# EAGLE design wavelet7 (EAGLE 9.2.1)
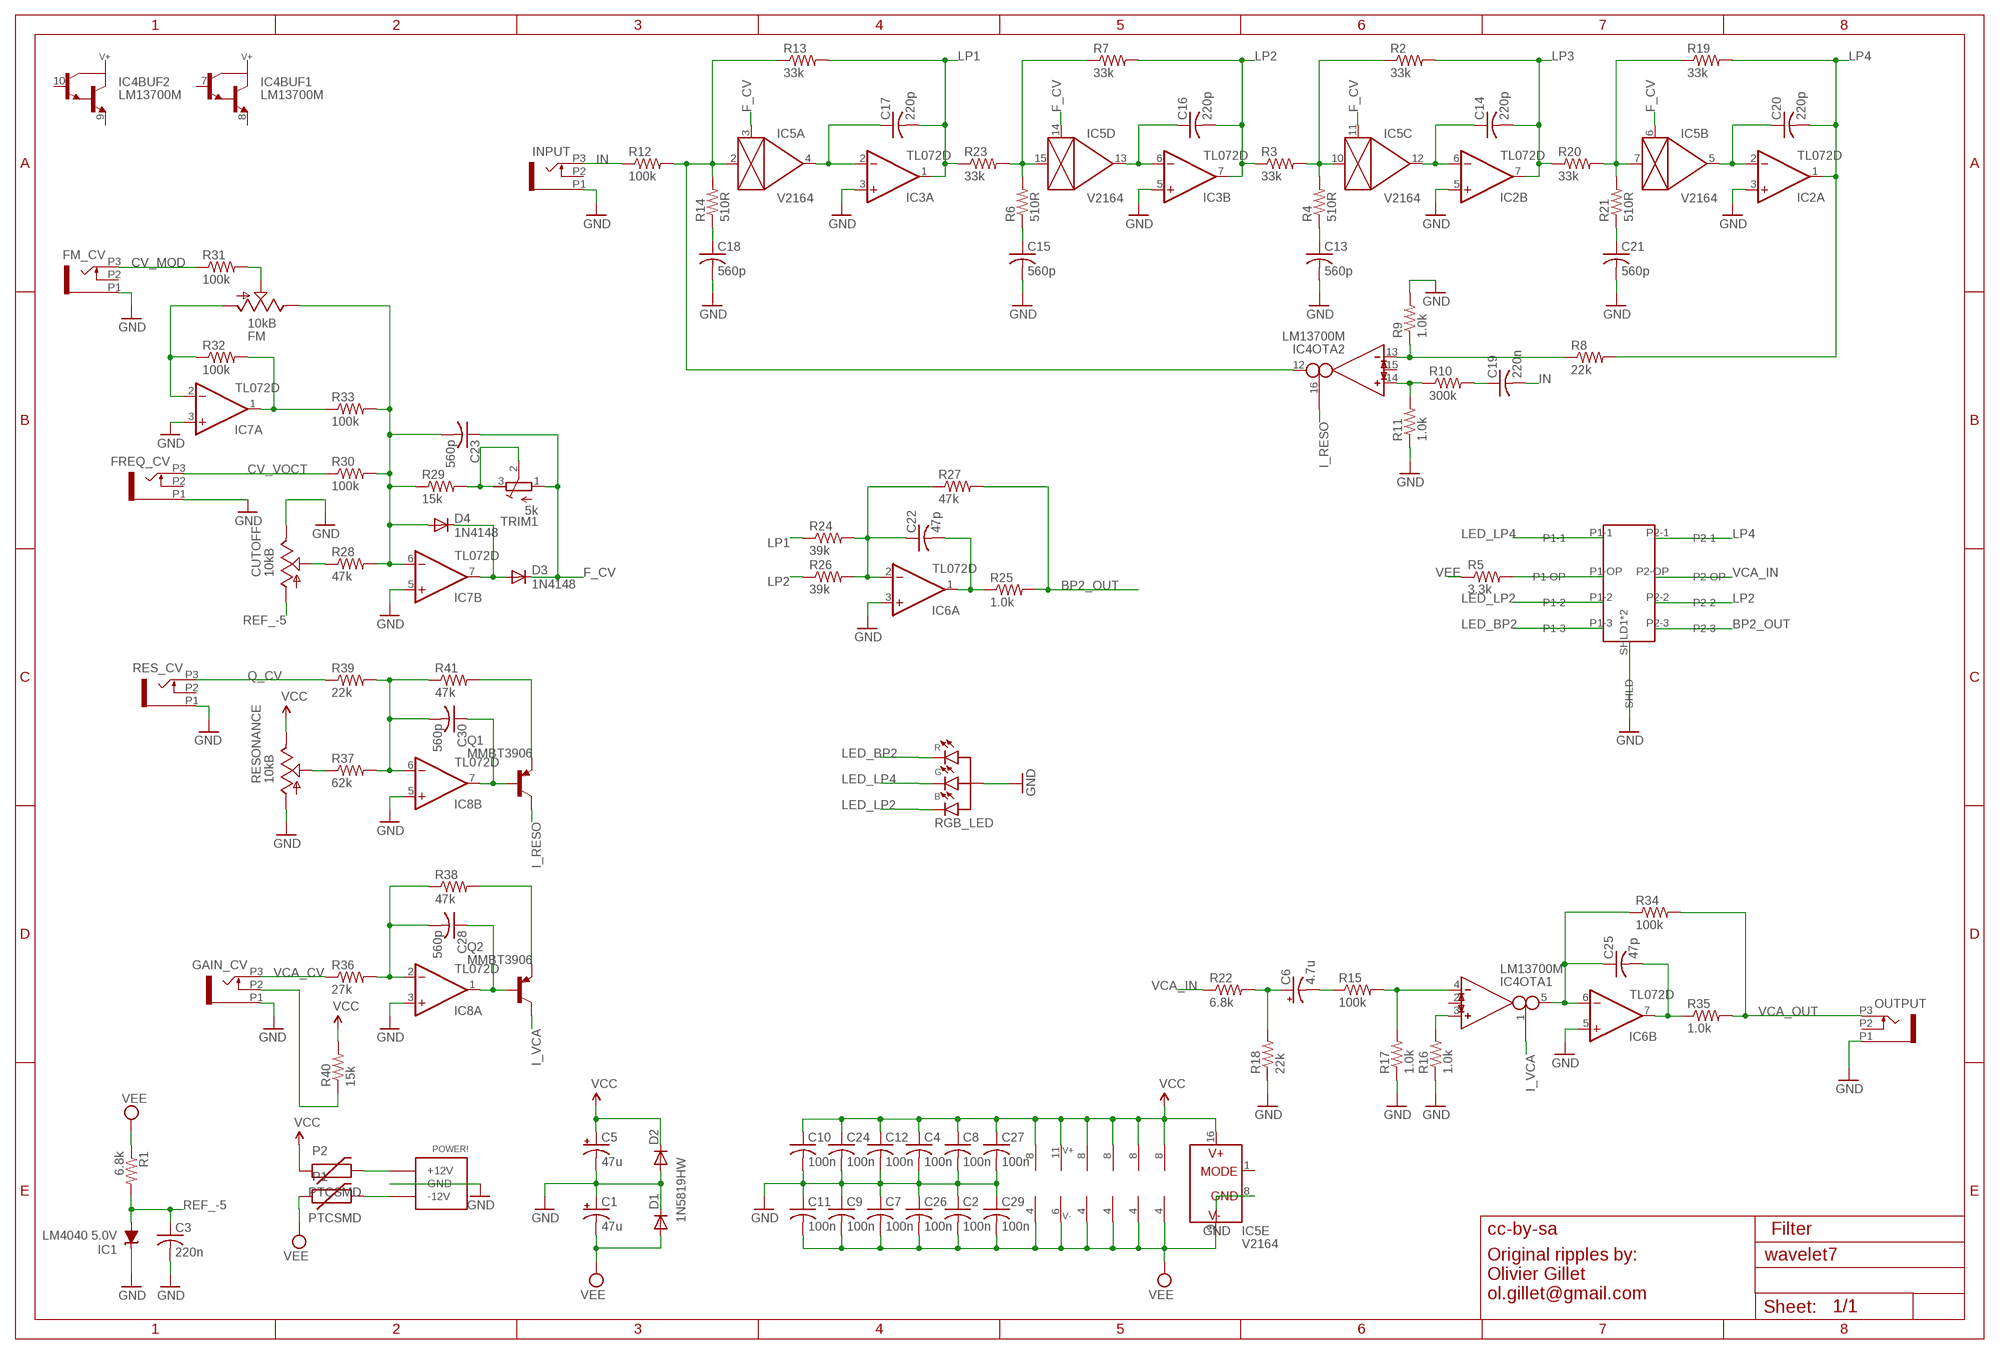
[diagram p0: schematic, sheet 1]

## Parts
C1  47u  CPOL-USD  [PANASONIC_D]
C2  100n  C-USC0603  [C0603]
C3  220n  C-USC0603  [C0603]
C4  100n  C-USC0603  [C0603]
C5  47u  CPOL-USD  [PANASONIC_D]
C6  4.7u  CPOL-USB  [PANASONIC_B]
C7  100n  C-USC0603  [C0603]
C8  100n  C-USC0603  [C0603]
C9  100n  C-USC0603  [C0603]
C10  100n  C-USC0603  [C0603]
C11  100n  C-USC0603  [C0603]
C12  100n  C-USC0603  [C0603]
C13  560p  C-USC0603  [C0603]
C14  220p  C-USC0603  [C0603]
C15  560p  C-USC0603  [C0603]
C16  220p  C-USC0603  [C0603]
C17  220p  C-USC0603  [C0603]
C18  560p  C-USC0603  [C0603]
C19  220n  C-USC0603  [C0603]
C20  220p  C-USC0603  [C0603]
C21  560p  C-USC0603  [C0603]
C22  47p  C-USC0603  [C0603]
C23  560p  C-USC0603  [C0603]
C24  100n  C-USC0603  [C0603]
C25  47p  C-USC0603  [C0603]
C26  100n  C-USC0603  [C0603]
C27  100n  C-USC0603  [C0603]
C28  560p  C-USC0603  [C0603]
C29  100n  C-USC0603  [C0603]
C30  560p  C-USC0603  [C0603]
CUTOFF  10kB  POT_USVERTICAL_PS  [ALPS_POT_VERTICAL_PS]
D1  1N5819HW  DIODE-SOD123  [SOD123]
D2  1N5819HW  DIODE-SOD123  [SOD123]
D3  1N4148  DIODE-SOD323-W  [SOD323-W]
D4  1N4148  DIODE-SOD323-W  [SOD323-W]
FILTER_MODE  APEM-MHS233K  [APEM-MHS233K]
FM  10kB  POT_USVERTICAL_PS  [ALPS_POT_VERTICAL_PS]
FM_CV  OG-PJ301_PJ301_THONKICONN  [OG-PJ301_WQP_PJ_301M6_NO_HOLE]
FREQ_CV  OG-PJ301_PJ301_THONKICONN  [OG-PJ301_WQP_PJ_301M6_NO_HOLE]
GAIN_CV  OG-PJ301_PJ301_THONKICONN  [OG-PJ301_WQP_PJ_301M6_NO_HOLE]
IC1  LM4040 5.0V  LM4041C12DBZ  [DBZ_R-PDSO-G3]
IC2  TL072D  [SO08]
IC3  TL072D  [SO08]
IC4  LM13700M  [SO16]
IC5  V2164  SSM2164S  [SOIC16N]
IC6  TL072D  [SO08]
IC7  TL072D  [SO08]
IC8  TL072D  [SO08]
INPUT  OG-PJ301_PJ301_THONKICONN  [OG-PJ301_WQP_PJ_301M6_NO_HOLE]
OUTPUT  OG-PJ301_PJ301_THONKICONN  [OG-PJ301_WQP_PJ_301M6_NO_HOLE]
P1  PTCSMD  [PTC-1206]
P2  PTCSMD  [PTC-1206]
POWER!  POWER_SIMPLE  [2X05_SMT_HEADER]
Q1  MMBT3906  MMBT3906LT1-PNP-SOT23-BEC  [SOT23-BEC]
Q2  MMBT3906  MMBT3906LT1-PNP-SOT23-BEC  [SOT23-BEC]
R1  6.8k  R-US_R0603  [R0603]
R2  33k  R-US_R0603  [R0603]
R3  33k  R-US_R0603  [R0603]
R4  510R  R-US_R0603  [R0603]
R5  3.3k  R-US_R0603  [R0603]
R6  510R  R-US_R0603  [R0603]
R7  33k  R-US_R0603  [R0603]
R8  22k  R-US_R0603  [R0603]
R9  1.0k  R-US_R0603  [R0603]
R10  300k  R-US_R0603  [R0603]
R11  1.0k  R-US_R0603  [R0603]
R12  100k  R-US_R0603  [R0603]
R13  33k  R-US_R0603  [R0603]
R14  510R  R-US_R0603  [R0603]
R15  100k  R-US_R0603  [R0603]
R16  1.0k  R-US_R0603  [R0603]
R17  1.0k  R-US_R0603  [R0603]
R18  22k  R-US_R0603  [R0603]
R19  33k  R-US_R0603  [R0603]
R20  33k  R-US_R0603  [R0603]
R21  510R  R-US_R0603  [R0603]
R22  6.8k  R-US_R0603  [R0603]
R23  33k  R-US_R0603  [R0603]
R24  39k  R-US_R0603  [R0603]
R25  1.0k  R-US_R0603  [R0603]
R26  39k  R-US_R0603  [R0603]
R27  47k  R-US_R0603  [R0603]
R28  47k  R-US_R0603  [R0603]
R29  15k  R-US_R0603  [R0603]
R30  100k  R-US_R0603  [R0603]
R31  100k  R-US_R0603  [R0603]
R32  100k  R-US_R0603  [R0603]
R33  100k  R-US_R0603  [R0603]
R34  100k  R-US_R0603  [R0603]
R35  1.0k  R-US_R0603  [R0603]
R36  27k  R-US_R0603  [R0603]
R37  62k  R-US_R0603  [R0603]
R38  47k  R-US_R0603  [R0603]
R39  22k  R-US_R0603  [R0603]
R40  15k  R-US_R0603  [R0603]
R41  47k  R-US_R0603  [R0603]
RES_CV  OG-PJ301_PJ301_THONKICONN  [OG-PJ301_WQP_PJ_301M6_NO_HOLE]
RESONANCE  10kB  POT_USVERTICAL_PS  [ALPS_POT_VERTICAL_PS]
RGB_LED  LED-RGB-CA-HEBEI  [PLCC4]
TRIM1  5k  R-TRIMM3296X  [RTRIM3296X]

## Nets
BP2_OUT: FILTER_MODE.P2-3 R25.2 R27.2
CV_F_POT: CUTOFF.P$2(S) R28.1
CV_MOD: FM_CV.P3 R31.1
CV_VOCT: FREQ_CV.P3 R30.1
F_CV: C23.1 D3.C IC5.3(A:CTRL) IC5.6(B:CTRL) IC5.11(C:CTRL) IC5.14(D:CTRL) TRIM1.1(E)
GND: C1.+ C2.1 C3.2 C4.2 C5.- C7.1 C8.2 C9.1 C10.2 C11.1 C12.2 C13.2 C15.2 C18.2 C21.2 C24.2 C26.1 C27.2 C29.1 CUTOFF.P$1(E) D1.C D2.A FILTER_MODE.SHLD1(SHLD) FILTER_MODE.SHLD2(SHLD) FM_CV.P1 FREQ_CV.P1 GAIN_CV.P1 IC1.1(C) IC2.3(A:+IN) IC2.5(B:+IN) IC3.3(A:+IN) IC3.5(B:+IN) IC5.8(E:GND) IC6.3(A:+IN) IC6.5(B:+IN) IC7.3(A:+IN) IC7.5(B:+IN) IC8.3(A:+IN) IC8.5(B:+IN) INPUT.P1 OUTPUT.P1 POWER!.3(GND) POWER!.4(GND) POWER!.5(GND) POWER!.6(GND) POWER!.7(GND) POWER!.8(GND) R9.2 R11.1 R16.1 R17.1 R18.1 RES_CV.P1 RESONANCE.P$3(A) RGB_LED.P$2(A)
I_RESO: IC4.16(OTA2:I_BIAS) Q1.C
I_VCA: IC4.1(OTA1:I_BIAS) Q2.C
IN: C19.2 INPUT.P3 R12.1
LED_BP2: FILTER_MODE.P1-3 RGB_LED.P$1(CR)
LED_LP2: FILTER_MODE.P1-2 RGB_LED.P$3(CB)
LED_LP4: FILTER_MODE.P1-1 RGB_LED.P$4(CG)
LP1: C17.2 IC3.1(A:OUT) R13.2 R23.1 R24.1
LP2: C16.2 FILTER_MODE.P2-2 IC3.7(B:OUT) R3.1 R7.2 R26.1
LP3: C14.2 IC2.7(B:OUT) R2.2 R20.1
LP4: C20.2 FILTER_MODE.P2-1 IC2.1(A:OUT) R8.2 R19.2
N$1: IC7.1(A:OUT) R32.2 R33.1
N$2: C17.1 IC3.2(A:-IN) IC5.4(A:OUT)
N$3: IC5.15(D:IN) R6.2 R7.1 R23.2
N$4: R29.2 TRIM1.2(S) TRIM1.3(A)
N$5: IC4.3(OTA1:IN_P) R16.2
N$6: P2.2 POWER!.9(+12V) POWER!.10(+12V)
N$7: C19.1 R10.2
N$8: C18.1 R14.1
N$9: C16.1 IC3.6(B:-IN) IC5.13(D:OUT)
N$10: IC4.12(OTA2:OUT) IC5.2(A:IN) R12.2 R13.1 R14.2
N$11: C15.1 R6.1
N$12: IC5.10(C:IN) R2.1 R3.2 R4.2
N$13: C14.1 IC2.6(B:-IN) IC5.12(C:OUT)
N$14: IC4.13(OTA2:IN_N) R8.1 R9.1
N$15: C13.1 R4.1
N$16: IC5.7(B:IN) R19.1 R20.2 R21.2
N$17: C20.1 IC2.2(A:-IN) IC5.5(B:OUT)
N$18: IC4.14(OTA2:IN_P) R10.1 R11.2
N$19: C21.1 R21.1
N$20: P1.2 POWER!.1(-12V) POWER!.2(-12V)
N$21: FM.P$2(S) R31.2
N$22: FM.P$3(A) IC7.2(A:-IN) R32.1
N$23: C23.2 D4.A FM.P$1(E) IC7.6(B:-IN) R28.2 R29.1 R30.2 R33.2
N$24: R37.1 RESONANCE.P$2(S)
N$25: C28.2 IC8.2(A:-IN) R36.2 R38.1
N$26: C30.2 IC8.6(B:-IN) R37.2 R39.2 R41.1
N$27: C30.1 IC8.7(B:OUT) Q1.B
N$28: Q1.E R41.2
N$29: GAIN_CV.P2 R40.1
N$30: C28.1 IC8.1(A:OUT) Q2.B
N$31: Q2.E R38.2
N$32: C6.+ R18.2 R22.2
N$34: FILTER_MODE.P1-OP R5.2
N$38: D3.A D4.C IC7.7(B:OUT)
N$40: C22.1 IC6.2(A:-IN) R24.2 R26.2 R27.1
N$41: C22.2 IC6.1(A:OUT) R25.1
N$42: IC4.4(OTA1:IN_N) R15.2 R17.2
N$43: C25.1 IC4.5(OTA1:OUT) IC6.6(B:-IN) R34.1
N$44: C25.2 IC6.7(B:OUT) R35.1
N$68: C6.- R15.1
Q_CV: R39.1 RES_CV.P3
REF_-5: C3.1 CUTOFF.P$3(A) IC1.2(A) R1.2
VCA_CV: GAIN_CV.P3 R36.1
VCA_IN: FILTER_MODE.P2-OP R22.1
VCA_OUT: OUTPUT.P3 R34.2 R35.2
VCC: C4.1 C5.+ C8.1 C10.1 C12.1 C24.1 C27.1 D2.C IC2.8(P:V+) IC3.8(P:V+) IC4.11(SUPPLY:V+) IC5.16(E:V+) IC6.8(P:V+) IC7.8(P:V+) IC8.8(P:V+) P2.1 R40.2 RESONANCE.P$1(E)
VEE: C1.- C2.2 C7.2 C9.2 C11.2 C26.2 C29.2 D1.A IC2.4(P:V-) IC3.4(P:V-) IC4.6(SUPPLY:V-) IC5.9(E:V-) IC6.4(P:V-) IC7.4(P:V-) IC8.4(P:V-) P1.1 R1.1 R5.1
Unconnected: FM_CV.P2 FREQ_CV.P2 IC4.2(OTA1:I_DIODE) IC4.7(BUF1:B) IC4.8(BUF1:E) IC4.9(BUF2:E) IC4.10(BUF2:B) IC4.15(OTA2:I_DIODE) IC5.1(E:MODE) INPUT.P2 OUTPUT.P2 RES_CV.P2

## Notes on the sheet
- cc-by-sa | Filter
- Original ripples by:
- Olivier Gillet
- ol.gillet@gmail.com

## Library data of the parts
C1 C5 C6 = rcl:CPOL-US: POLARIZED CAPACITOR, American symbol
C2-C4 C7-C30 = rcl:C-US: CAPACITOR, American symbol
CUTOFF FM RESONANCE = pot-alps:POT_US
D1-D4 = diode:DIODE-: DIODE
FILTER_MODE = Wavelet:APEM-MHS233K
FM_CV FREQ_CV GAIN_CV INPUT OUTPUT RES_CV = SHAY_THONKICONNS:OG-PJ301_PJ301_THONKICONN
IC1 = texas:LM4041: PRECISION MICROPOWER SHUNT VOLTAGE REFERENCE Source: http://focus.ti.com/lit/ds/slcs146e/slcs146e.pdf
IC2 IC3 = og-linear:TL072: OP AMP
IC4 = ota:LM13700: Dual OTA with buffers
IC5 = ssm2164:SSM2164
IC6-IC8 = linear:TL072: OP AMP
P1 P2 = SparkFun:PTC: Resettable Fuse PTC Resettable Fuse. Spark Fun Electronics SKU : COM-08357
POWER! = EurorackModularParts:POWER_SIMPLE
Q1 Q2 = transistor:*-PNP-: PNP Transistror
R1 = resistor:R-US_: RESISTOR, American symbol
R2-R41 = rcl:R-US_: RESISTOR, American symbol
RGB_LED = 4ms-main-parts:LED-RGB-CA: Hebei I.T. (Shanghai) PLCC4RGBCT-CA
TRIM1 = rcl:R-TRIMM: Trimm resistor

## Board
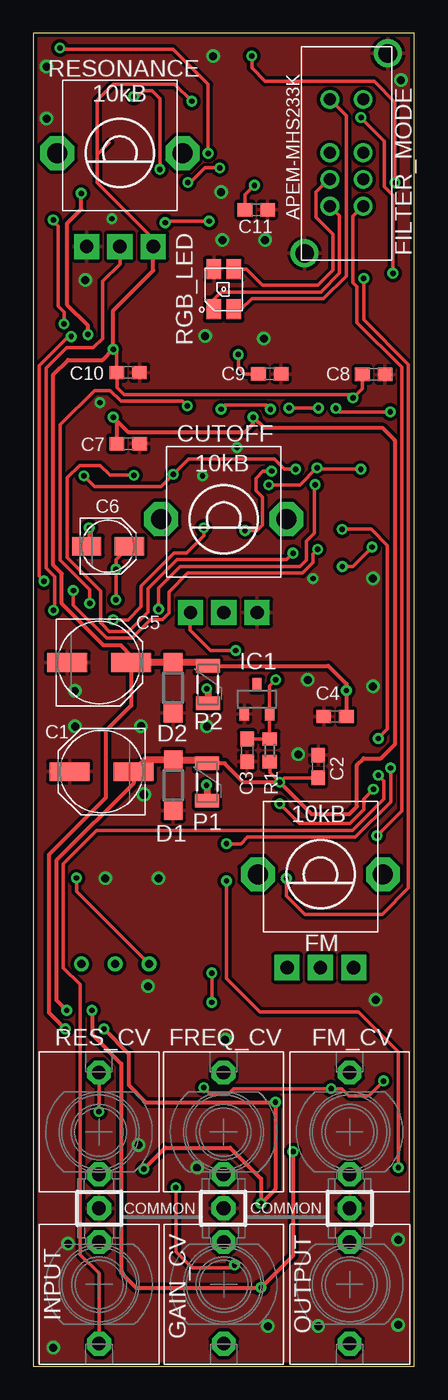
[diagram p1: board, top side]
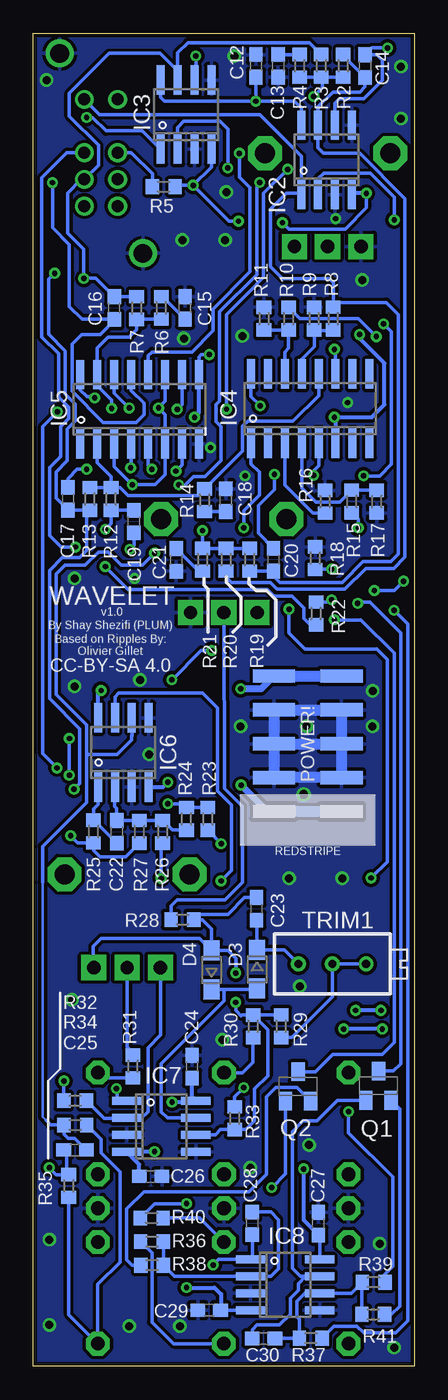
[diagram p2: board, bottom side, seen from below]

Size 28.6 x 100 mm. Coordinates in mm from the lower left corner, seen from the top.
Outline: 0,0 28.6,0 28.6,100 0,100 0,0
Copper layers (1*16): Top 0.035mm / dielectric 1.5mm / Bottom 0.035mm
Design rules "default *": minimum track width 6mil, minimum drill 0.4mm, track to track 10mil, track to pad 8mil, pad to pad 10mil, via to via 10mil, smd to smd 6mil, copper to edge 10mil, drill to drill 5mil, minimum pad ring 10mil, minimum via ring 8mil, stop-mask expansion 4mil, vias tented up to drill 24mil, thermal gap 10mil

### Footprints (pad centres in the part's own frame; a part is rotated, then mirrored left to right if it is on the bottom)
PANASONIC_D = smd 3 x 1.4: + 2.4,0; - -2.4,0
C0603 = smd 1.1 x 1: 1 -0.85,0; 2 0.85,0
PANASONIC_B = smd 2.2 x 1.4: + 1.6,0; - -1.6,0
ALPS_POT_VERTICAL_PS = drill 1 pad 1.88 square: P$1 -2.5,7; P$2 0,7; P$3 2.5,7 | drill 1.5 pad 2.54 octagon: P$4 -4.7,0; P$5 4.7,0
SOD123 = smd 1.4 x 1.4: A 1.9,0; C -1.9,0
SOD323-W = smd 1.5 x 1.2: A 1.45,0; C -1.45,0
APEM-MHS233K = drill 0.9: P1-1 -1.25,4.05; P1-2 -1.25,-1.95; P1-3 -1.25,-3.95; P1-OP -1.25,0.05; P2-1 1.25,4.05; P2-2 1.25,-1.95; P2-3 1.25,-3.95; P2-OP 1.25,0.05 | drill 1.4: SHLD1 3.1,7.5; SHLD2 -3.15,-7.5
OG-PJ301_WQP_PJ_301M6_NO_HOLE = drill 1.016 pad 1.778 octagon: P1 0,-5.715; P2 0,-3.175; P3 0,4.445
DBZ_R-PDSO-G3 = smd 0.7 x 1: 1 -0.95,-1.1; 2 0.95,-1.1; 3 0,1.1
SO08 = smd 0.6 x 2.2: 1 -1.905,-2.6; 2 -0.635,-2.6; 3 0.635,-2.6; 4 1.905,-2.6; 5 1.905,2.6; 6 0.635,2.6; 7 -0.635,2.6; 8 -1.905,2.6
SO16 = smd 0.6 x 2.2: 1 -4.445,-2.6; 2 -3.175,-2.6; 3 -1.905,-2.6; 4 -0.635,-2.6; 5 0.635,-2.6; 6 1.905,-2.6; 7 3.175,-2.6; 8 4.445,-2.6; 9 4.445,2.6; 10 3.175,2.6; 11 1.905,2.6; 12 0.635,2.6; 13 -0.635,2.6; 14 -1.905,2.6; 15 -3.175,2.6; 16 -4.445,2.6
SOIC16N = smd 0.6 x 2.2: 1 -4.445,-2.6; 2 -3.175,-2.6; 3 -1.905,-2.6; 4 -0.635,-2.6; 5 0.635,-2.6; 6 1.905,-2.6; 7 3.175,-2.6; 8 4.445,-2.6; 9 4.445,2.6; 10 3.175,2.6; 11 1.905,2.6; 12 0.635,2.6; 13 -0.635,2.6; 14 -1.905,2.6; 15 -3.175,2.6; 16 -4.445,2.6
PTC-1206 = smd 1 x 1.8: 1 -1.4,0; 2 1.4,0
2X05_SMT_HEADER = smd 1 x 3.17: 1 -5.08,-2.54; 2 -5.08,2.54; 3 -2.54,-2.54; 4 -2.54,2.54; 5 0,-2.54; 6 0,2.54; 7 2.54,-2.54; 8 2.54,2.54; 9 5.08,-2.54; 10 5.08,2.54
SOT23-BEC = smd 1 x 1.4: B -0.95,-1.1; C 0,1.1; E 0.95,-1.1
R0603 = smd 1 x 1.1: 1 -0.85,0; 2 0.85,0
PLCC4 = smd 1.5 x 1.1: P$1 -1.5,0.75; P$2 1.5,0.75; P$3 1.5,-0.75; P$4 -1.5,-0.75
RTRIM3296X = drill 0.61: 1 0,-2.54; 2 0,0; 3 0,2.54

### Placement (x,y rotation side)
C1  5.13,44.61 180 top
C2  21.39,45 270 top
C3  16.05,46.21 270 top
C4  22.66,48.75 180 top
C5  4.96,52.79 0 top
C6  5.61,61.52 0 top
C7  7.13,69.21 180 top
C8  25.56,74.4 0 top
C9  17.75,74.45 180 top
C10  7.12,74.55 0 top
C11  16.74,86.76 180 top
C12  11.88,97.56 90 bottom
C13  10.22,97.56 270 bottom
C14  3.7,97.55 270 bottom
C15  17.21,79.4 90 bottom
C16  22.52,79.39 90 bottom
C17  25.99,65.08 270 bottom
C18  14.14,64.97 90 bottom
C19  21.04,63.37 90 bottom
C20  10.57,60.51 270 bottom
C21  17.87,60.49 270 bottom
C22  22.33,40.1 270 bottom
C23  11.84,34.32 90 bottom
C24  16.68,22.47 90 bottom
C25  25.47,16.23 180 bottom
C26  19.79,14.24 180 bottom
C27  7.2,10.7 90 bottom
C28  12.16,10.72 90 bottom
C29  15.4,4.2 0 bottom
C30  11.31,2.08 0 bottom
CUTOFF  14.3,63.55 180 top
D1  10.5,43.6 90 top
D2  10.49,50.9 270 top
D3  11.79,29.78 270 bottom
D4  15.21,29.73 90 bottom
FILTER_MODE  23.52,90.99 0 top
FM  21.56,36.9 180 top
FM_CV  23.75,17.57 0 top
FREQ_CV  14.28,17.57 0 top
GAIN_CV  14.3,6.13 180 top
IC1  16.79,50.04 0 top
IC2  6.58,90.51 0 bottom
IC3  17.13,93.9 0 bottom
IC4  7.81,71.84 0 bottom
IC5  20.62,71.8 0 bottom
IC6  21.84,46.05 0 bottom
IC7  19,18 270 bottom
IC8  9.7,6.1 270 bottom
INPUT  4.94,6.13 180 top
OUTPUT  23.76,6.13 180 top
P1  13.06,43.83 270 top
P2  13.11,51.15 270 top
POWER!  8,46.7 90 bottom
Q1  2.68,21.04 0 bottom
Q2  8.72,20.99 0 bottom
R1  17.76,46.21 90 top
R2  5.33,97.56 90 bottom
R3  6.98,97.56 270 bottom
R4  8.61,97.56 270 bottom
R5  18.81,88.49 180 bottom
R6  19,79.4 270 bottom
R7  20.84,79.39 90 bottom
R8  6.08,78.61 90 bottom
R9  7.52,78.6 90 bottom
R10  9.43,78.59 90 bottom
R11  11.28,78.59 270 bottom
R12  22.76,65.07 90 bottom
R13  24.36,65.07 270 bottom
R14  15.74,64.97 90 bottom
R15  4.69,64.88 90 bottom
R16  6.7,64.86 270 bottom
R17  2.82,64.87 90 bottom
R18  7.43,60.62 270 bottom
R19  12.36,60.51 270 bottom
R20  14.13,60.51 90 bottom
R21  15.89,60.51 90 bottom
R22  7.37,56.48 90 bottom
R23  15.49,41.07 270 bottom
R24  17.1,41.07 270 bottom
R25  24.08,40.11 270 bottom
R26  18.89,40.1 90 bottom
R27  20.63,40.1 270 bottom
R28  17.41,33.5 0 bottom
R29  9.99,25.51 270 bottom
R30  12.1,25.5 90 bottom
R31  21.12,22.48 90 bottom
R32  25.46,19.92 180 bottom
R33  13.48,18.61 270 bottom
R34  25.44,18.1 0 bottom
R35  25.94,13.52 270 bottom
R36  19.69,9.34 0 bottom
R37  7.77,2.1 180 bottom
R38  19.68,7.57 180 bottom
R39  3.05,6.3 180 bottom
R40  19.71,11.12 180 bottom
R41  3.08,3.89 0 bottom
RES_CV  4.93,17.57 0 top
RESONANCE  6.5,91.01 180 top
RGB_LED  14.3,80.8 90 top
TRIM1  6.15,30.17 270 bottom

### Tracks (layer width: path | path; a pad name or v marks a point on that pad's centre or on a via)
BP2_OUT  (via drill 0.4)
  Top 0.254: FILTER_MODE.P2-3 24.01,86.28 24.01,81.29 24.31,80.99 24.31,78.3 27.66,74.95 27.66,41.66 v25.8,39.8
  Bottom 0.254: R27.2 21.68,38.2 23.6,38.2 24.08,38.68 R25.2 25.26,39.26 v25.8,39.8
CV_F_POT
  Bottom 0.254: CUTOFF.P$2 14.26,43.35 12.9,41.99 12.9,36.3 14.2,35 17.8,35 18.26,34.54 R28.1
CV_MOD
  Bottom 0.254: R31.1 23.38,21.63 FM_CV.P3
CV_VOCT
  Bottom 0.254: R30.1 12.1,22.8 12.88,22.02 FREQ_CV.P3
F_CV  (via drill 0.4)
  Top 0.254: v19.2,71.89 v19.2,71.9 v19.21,71.89 v21.4,71.89 | TRIM1.1 3.24,35.62 v3.24,36.63 | v9.4,56.8 9.4,58.4 11,60 20,60 20.5,60.5 20.5,61.9 21.1,62.5 21.1,66.07 v21.16,66.14 21.32,66.29
  Bottom 0.254: IC5.11 18.7,74.42 18.7,72.39 v19.2,71.89 18.71,71.41 18.71,68.8 | 18.71,69.89 18.8,69.8 18.8,69.28 IC5.6 18.71,68.8 | 18.71,68.8 18.71,66.89 19.46,66.14 v21.16,66.14 22.52,67.5 IC5.3 22.5,69.17 22.5,69.04 | IC5.14 22.52,73.02 v21.4,71.89 | TRIM1.1 9.75,31.23 D3.C | D3.C 11.84,31.28 | v3.24,36.63 2.02,37.85 2.02,53.02 2.8,53.8 8.2,53.8 9.4,55 v9.4,56.8 9.4,56.14 | C23.1 11.79,33.42 D3.C
GND  (via drill 0.4, 0.6, 0.65)
  Bottom 0.254: IC3.3
  Bottom 0.813: POWER!.6 7.9,46.7 POWER!.5 | POWER!.5 POWER!.7 POWER!.8 POWER!.6 | POWER!.5 POWER!.3 POWER!.4 POWER!.6
  other vias: 3.11,50.66 3.14,48.01 19.9,45.9 21,59.1 12.7,66.8 15.29,68.92 13.03,48 8.08,48.02 8.3,42.9 5.9,86.1 5,72.3 14.1,88.1 12.9,77.3 1,97.5 1,93.6 13.5,98.3 27.6,96.5 14.2,84.5 17.4,84.5 3.9,81.5 17.3,77.1 25.5,59.1 25.5,51 20.6,51.5 5.4,36.6 9.4,36.6 8.6,28.5 25.7,27.5 14.4,24.5 12.3,14.9 27.4,9.5 27.4,3.1 1.5,1.4 17.6,3 21.4,3 2.6,9.2 7.9,16.6
  pour Top (rank 6): 29,100.5 -0.5,100.5 -0.5,99.5 -0.5,-0.5 29,-0.5
  pour Bottom (rank 6): 29,100.5 -0.5,100.5 -0.5,99.5 -0.5,-0.5 29,-0.5
I_RESO  (via drill 0.4)
  Top 0.254: v4.24,57.24 4.24,58.26 2.03,60.47 2.03,70.63 4.6,73.2 5.78,73.2 6.59,72.39 11.22,72.39 v11.55,72.06
  Bottom 0.254: v4.24,57.24 4.13,57.35 3.35,57.35 1,55 1,22.7 1.56,22.14 Q1.C | 12.26,73.55 IC4.16 12.26,72.75 v11.55,72.06
I_VCA  (via drill 0.4)
  Top 0.254: v6,56 7.11,56 8.11,57 8.11,58.55 10.58,61.02 11.5,61.02 12.8,62.32 v12.8,62.9
  Bottom 0.254: IC4.1 12.26,67.7 11.63,67.07 11.63,65.37 12.8,64.2 v12.8,62.9 | Q2.C 7.41,22.09 6.1,23.4 2.41,23.4 1.51,24.3 1.51,53.5 4.01,56 v6,56
IN  (via drill 0.4)
  Top 0.254: v23.19,62.79 25.38,62.79 26.6,61.57 26.6,47.8 v25.9,47.1 | INPUT.P3 4.94,6.96 3.53,8.37 3.53,28.63 2.26,29.9 2.26,37.7 4.76,40.2 23.97,40.2 26.32,42.55 26.32,43.92 v25.9,44.34
  Bottom 0.254: v23.19,62.79 22.76,63.22 R12.1 22.62,64.22 C19.2 | v25.9,44.34 v25.9,47.1
LED_BP2
  Top 0.254: RGB_LED.P$1 13.55,80.05 14.1,80.6 21.58,80.6 22.99,82.01 22.99,86.32 FILTER_MODE.P1-3
LED_LP2
  Top 0.254: FILTER_MODE.P1-2 22.14,89.04 21.2,88.1 21.2,86.2 22.48,84.92 22.48,82.22 21.37,81.11 17.2,81.11 16.01,82.3 RGB_LED.P$3
LED_LP4
  Top 0.254: FILTER_MODE.P1-1 23.5,93.81 23.5,81.8 21.79,80.09 16.4,80.09 15.61,79.3 RGB_LED.P$4
LP1  (via drill 0.4)
  Top 0.254: v18.5,42.2 19.99,40.71 23.76,40.71 24.83,41.78 24.83,42.57 v25.54,43.28 | 27.1,82 v27,82 27,87.85 26.37,88.47 26.37,91.9 v24.6,93.68
  Bottom 0.254: v18.5,42.2 17.38,42.2 R24.1 R23.1 | 25.99,72.71 26.2,72.93 | 27.39,51.91 27.39,53.1 | 27.39,53.1 27.39,59.7 26.42,60.67 25.12,60.67 24.6,61.19 24.6,63.98 R13.2 C17.2 26.88,65.12 26.88,67.1 26.04,67.94 26.04,70.3 25.44,70.9 25.44,72.17 26.2,72.93 | 26.2,72.93 26.2,76.1 26.2,76.16 27.46,77.42 27.46,81.54 v27,82 | 26.2,72.93 | 19,91.27 IC3.1 20.43,92.69 23.14,92.69 24.13,93.68 v24.6,93.68 | v25.54,43.28 25.11,43.71 25.11,47.8 27.39,50.08 27.39,53.1
LP2  (via drill 0.4)
  Top 0.254: v19,36.6 19,35.3 20.4,33.9 26.2,33.9 28.17,35.87 28.17,75.16 24.82,78.51 v24.82,81.61 v24.81,81.62
  Bottom 0.203: 17.8,96.47 IC3.7
  Bottom 0.254: R7.2 C16.2 23.9,81.62 v24.81,81.62 24.81,83.79 26.02,85 26.02,88.02 25,89.04 FILTER_MODE.P2-2 23.7,90.11 23.7,91.6 25.9,93.8 25.9,95.5 22.9,98.5 19.07,98.5 17.77,97.2 | v19,36.6 19,39.14 R26.1 | 17.77,95.53 17.77,96.4 IC3.7 17.77,97.2 | R3.1 7.87,99.3 17,99.3 17.77,98.53 17.77,97.2
LP3
  Bottom 0.254: R2.2 5.33,98.33 C14.2 3.7,96 4.1,95.6 6.1,95.6 7.21,94.48 IC2.7 | R20.1 14.13,59.2 13.71,58.78 10.79,58.78 10.31,58.3 5.19,58.3 3.64,59.85 1.55,59.85 0.69,60.71 0.69,76.7 0.69,87.61 4.08,91 6.82,91 7.21,91.4 IC2.7 | 7.2,93.12 IC2.7
LP4
  Bottom 0.254: R19.2 C20.2 10.5,59.66 | 10.5,59.66 10.35,59.66 | 10.5,59.66 10.5,59.21 10.1,58.81 5.4,58.81 3.85,60.36 1.76,60.36 1.2,60.92 1.2,77.2 1.2,78.9 2.1,79.8 6.08,79.8 R8.2 6.08,81.28 6.4,81.6 9.9,81.6 10.8,82.5 10.8,86.8 9.6,88 8.48,88 | IC2.1 8.48,88 | 8.48,88 8.48,90.78 11.6,93.9 23.63,93.9 FILTER_MODE.P2-1
N$1  (via drill 0.4)
  Top 0.254: v26.3,21.4 25.2,20.3 23.7,20.3 23.18,20.82 v22.37,20.82 15.02,20.82 14.6,20.4 13.3,20.4 v12.8,20.9
  Bottom 0.254: 22.4,19.91 22.3,19.91 | 22.3,19.91 IC7.1 | v26.3,21.4 v26.31,21.39 R32.2 | v12.8,20.9 13.48,20.22 R33.1 | v22.37,20.82 22.3,20.75 22.3,19.91
N$2  (via drill 0.4)
  Top 0.254: v24.59,67.3 21.4,67.3 v21.3,67.4 20.02,66.12 v17.67,66.12 | v11.61,88.81 11.7,88.71 11.7,88.7 12.9,89.9 v14,89.9
  Bottom 0.254: v21.3,67.4 21.25,67.44 IC5.4 | v17.67,66.12 17.19,66.12 16.55,66.75 15.7,66.75 14.5,67.95 14.5,70.5 14.88,70.89 14.88,72.13 14.61,72.41 14.61,75.7 | v24.59,67.3 25.3,67.3 26,66.6 C17.1 | IC3.2 17.77,91.1 17.77,92.94 17.31,93.39 14.59,93.39 14,92.8 v14,89.9 | 14.61,75.7 14.61,75.81 | 14.61,75.7 14.61,79.11 11.82,81.9 11.82,88.59 v11.61,88.81
N$3  (via drill 0.4)
  Top 0.254: v14.5,39.2 15.6,39.2 16.09,39.69 24.18,39.69 26.83,42.34 26.83,44.88 v26.82,44.89 | v26.8,71.6 22.97,71.6 v22.72,71.85
  Bottom 0.203: 20.9,78.48 R7.1
  Bottom 0.254: R6.2 R7.1 20.84,77.76 21.4,77.2 22.98,77.2 23.8,76.39 IC5.15 23.8,73.57 22.72,72.49 v22.72,71.85 | R23.2 14.5,39.23 v14.5,39.2 | v26.8,71.6 27.89,70.51 27.89,45.95 v26.82,44.89
N$4
  Bottom 0.254: TRIM1.3 TRIM1.2 6.15,27.7 9.19,24.66 R29.2
N$5
  Bottom 0.254: R16.2 7.6,64 9.71,66.11 IC4.3
N$6  (via drill 0.4)
  Top 0.508: v13.02,50.82 13.11,50.73 P2.2
  Bottom 0.508: POWER!.10 11.5,50.82 v13.02,50.82
  Bottom 0.813: POWER!.10 POWER!.9
N$7  (via drill 0.4)
  Top 0.254: v0.8,58.9 0.8,58.93 0.46,59.27 0.46,75.08 2.63,77.25 v2.85,77.25 | v3,58.2 3,57.11 5.5,54.61 7.41,54.61 8.82,56.02 9.72,56.02 10.2,56.49 10.2,58.1 11.59,59.49 20.21,59.49 21.01,60.29 21.01,60.95 v21.35,61.29
  Bottom 0.254: v0.8,58.9 1.5,58.2 v3,58.2 | C19.1 21.04,61.6 v21.35,61.29 | v2.85,77.25 3.32,77.72 4.18,78.59 6.77,78.59 6.78,78.58 8.57,78.58 R10.2
N$8
  Bottom 0.254: R14.1 C18.1
N$9  (via drill 0.4)
  Top 0.254: v27.16,88.8 27.16,91.74 27.16,94.84 25.6,96.4 17.4,96.4 16.4,97.4 v16.4,98.3
  Bottom 0.203: C16.1 22.38,78.68
  Bottom 0.254: IC5.13 21.25,75.25 | IC5.13 21.25,73.2 20.3,72.25 20.3,71.4 20.9,70.8 23.35,70.8 25.7,73.14 25.7,76.69 24.98,77.4 23.6,77.4 22.38,78.62 22.38,78.68 | 22.52,78.38 C16.1 24.94,78.54 25.9,79.5 25.9,81.5 | 21.2,74.45 IC5.13 | 25.9,81.5 25.9,81.99 | 25.9,81.5 25.9,84.16 27.16,85.42 v27.16,88.8 | v16.4,98.3 16.4,96.59 IC3.6
N$10
  Bottom 0.254: R12.2 R13.1 | R12.2 22.76,66.76 23.8,67.8 IC5.2 | 11,70.9 11.2,70.9 12.5,70.9 12.88,70.52 12.88,68.67 R14.2 16.24,65.32 21.5,65.32 22.1,65.92 R12.2 | 11,70.9 9.1,70.9 7.17,72.83 IC4.12 | 11,70.9
N$11
  Bottom 0.254: C15.1 18.91,80.25 R6.1
N$12  (via drill 0.4)
  Top 0.254: v17.8,71.8 17.5,72.1 14.39,72.1 v14.1,71.81 | v7.54,95.27 7.86,95.27 8.28,95.68 8.93,95.68 9.5,95.11 v9.5,89.8
  Bottom 0.254: IC5.10 17.45,72.16 v17.8,71.8 | R4.2 R3.2 6.9,96.71 | 6.9,96.71 R2.1 | 14.28,71.99 v14.1,71.81 14.1,78.9 12.4,80.6 | 12.4,80.6 12.3,80.7 | 12.4,80.6 11.31,81.69 11.31,87.99 v9.5,89.8 | v7.54,95.27 6.9,95.91 6.9,96.71
N$13  (via drill 0.4)
  Top 0.254: v2,98.9 2.1,98.8 10.5,98.8 11.8,97.5 13.13,96.17 v13.13,91
  Bottom 0.254: 5.8,93.25 IC2.6 5.95,94.75 5.61,95.09 3.79,95.09 2.4,96.48 2.4,98 2.8,98.4 C14.1 3.2,98.9 v2,98.9 | IC5.12 19.98,75.81 19.7,76.1 16.7,76.1 15.12,77.68 15.12,79.32 12.32,82.11 12.32,88.42 | 12.32,88.42 | 12.32,88.42 13.13,89.22 v13.13,91
N$14
  Bottom 0.254: R9.1 7.47,77.7 | R8.1 6.08,77.7 7.47,77.7 | IC4.13 8.45,75.56 7.5,76.5 7.5,77.67 7.47,77.7
N$15
  Bottom 0.254: R4.1 C13.1
N$16  (via drill 0.4)
  Top 0.254: v17.89,67.16 17.26,67.16 16.7,66.6 16.7,65.7 17.2,65.2 17.2,63.1 16.8,62.7 v15.9,62.7
  Bottom 0.254: R19.1 R20.2 R21.2 | IC5.7 17.45,67.61 v17.89,67.16 | 15.93,61.4 R21.2 | R21.2 v15.9,62.7
N$17  (via drill 0.4)
  Top 0.254: v19.7,67.3 18.87,67.3 18.11,68.06 11.65,68.06 v10.5,66.91 | 10.61,66.8 v10.5,66.91 | v10.5,66.91 9.59,66 4.6,66 v3.8,66.8 | v2.3,78.2 2.3,79.1 1.85,79.55 1.85,85.55 1.45,85.95 v1.5,86
  Bottom 0.254: C20.1 11.7,62.49 11.7,64.58 10.5,65.78 v10.5,66.91 | v3.8,66.8 2.6,66.8 1.71,67.69 1.71,76.99 1.71,77.61 v2.3,78.2 | IC5.5 19.98,67.58 v19.7,67.3 | IC2.2 7.21,89.08 6.8,89.5 3.3,89.5 1.5,87.7 v1.5,86
N$18
  Bottom 0.254: 11.18,77.64 R11.2 R10.1 9.43,76.37 9.7,76.1 9.7,75.1 9.6,75 9.71,74.89 IC4.14
N$19
  Bottom 0.254: C21.1 16.19,59.66 R21.1
N$20  (via drill 0.4)
  Top 0.508: P1.2 13.06,43.54 v13,43.6
  Bottom 0.508: 10.46,41.7 POWER!.2 11.02,41.62 v13,43.6 | 4.5,41.7 5.38,41.7 POWER!.1
  Bottom 0.813: POWER!.1 POWER!.2
N$21
  Bottom 0.254: FM.P$2 21.56,23.96 21.1,23.5 21.1,23.35 R31.2
N$22
  Bottom 0.254: FM.P$3 19.06,24.84 20,23.9 20,19.1 20.5,18.6 20.54,18.64 IC7.2 21.64,18.6 23.29,18.6 R32.1
N$23  (via drill 0.4)
  Top 0.254: v13.4,29.5 v13.4,27.3
  Bottom 0.254: R30.2 R29.1 | D4.A 15.37,31.34 15.2,31.5 | 13.88,17.36 13.57,17.67 R33.2 | R30.2 11,25.25 11,21.8 12,20.8 12,18.4 12.64,17.76 R33.2 | R33.2 14.54,17.76 14.94,17.36 IC7.6 | D4.A 16.13,32.1 23.5,32.1 24.1,31.5 24.1,29.94 FM.P$1 | D4.A 13.98,31.18 13.4,30.6 v13.4,29.5 | v13.4,27.3 13.4,26.7 13,26.3 12.95,26.35 R30.2 | D4.A 15.21,32.81 15.9,33.5 R28.2 16.16,33.9 14,33.9 12.73,35.17 C23.2
N$24  (via drill 0.4)
  Top 0.254: v1.5,56.7 1.6,56.8 1.6,59.25 0.97,59.88 0.97,74.87 2.5,76.4 4.5,76.4 5.2,77.1 5.2,81.4 6.5,82.7 RESONANCE.P$2
  Bottom 0.254: R37.1 6.02,3 4.3,3 3.8,2.5 1.4,2.5 0.49,3.41 0.49,55.69 v1.5,56.7
N$25
  Bottom 0.254: R38.1 | R36.2 18.84,9.3 | 18.84,9.3 18.84,8.97 | C28.2 10.77,11.57 10.2,11 10.2,7.3 10.77,6.74 IC8.2 18,6.74 R38.1 | R38.1 18.83,9.29 18.84,9.3
N$26
  Bottom 0.254: IC8.6 6.55,5.46 | R39.2 3.88,6.32 | 4.3,5.9 R39.2 | IC8.6 4.74,5.46 R39.2 | R41.1 3.93,6.27 R39.2 | IC8.6 8.2,5.46 8.8,4.87 8.8,3.69 8.62,3.51 R37.2 8.64,2.08 C30.2
N$27
  Bottom 0.254: Q1.B 5.76,19.94 7.3,18.4 8.36,18.4 9.16,17.6 9.16,7.36 8.54,6.74 7.2,6.74 | 7.2,6.74 IC8.7 | 11.9,2.34 C30.1 12.16,2.74 11.8,3.1 10.11,3.1 9.31,3.9 9.31,5.08 8.7,5.68 8.7,6.2 8.16,6.74 7.2,6.74
N$28
  Bottom 0.254: 1.6,19.81 Q1.E 1.1,19.31 1.1,4.5 1.71,3.89 R41.2 2.35,4.01
N$29
  Bottom 0.254: 18.79,11.2 R40.1 16.11,11.12 GAIN_CV.P2
N$30  (via drill 0.4)
  Top 0.254: v10.7,13.4 10.7,8.6 11.9,7.4 14.9,7.4 v15.1,7.6
  Bottom 0.254: 11.4,8.01 12,8.01 | 12,8.01 IC8.1 14.7,8.01 v15.1,7.6 | 12.2,9.83 C28.1 12.16,8.16 12,8.01 | Q2.B 9.67,14.43 v10.7,13.4
N$31
  Bottom 0.254: 20.77,7.57 R38.2 21.17,7.57 21.59,7.99 21.59,11.81 20.3,13.1 12.4,13.1 11.1,14.4 11.1,20.22 10.4,20.92 10.1,20.92 | Q2.E 8.8,20.92 10.1,20.92 | 10.31,20.92 10.1,20.92
N$32  (via drill 0.4)
  Top 0.254: C6.+ 6.2,60.51 v6.2,59.8 v6.2,57.5
  Bottom 0.254: v6.2,59.8 7.4,59.8 R18.2 | v6.2,57.5 6.37,57.33 R22.2
N$34
  Bottom 0.254: R5.2 19.66,89.46 21.24,91.04 FILTER_MODE.P1-OP
N$38
  Bottom 0.254: D3.A 11.84,28.28 14.3,28.28 | 14.3,28.28 D4.C | IC7.7 18.54,18.64 19,19.1 19,22.7 14.3,27.4 14.3,28.28
N$40
  Bottom 0.254: IC6.2 22.5,43.42 22.5,42 22.33,41.83 C22.1 R27.1 R26.2 18.16,40.22 R24.2
N$41
  Bottom 0.254: IC6.1 23.75,42.16 24.08,41.82 R25.1 24.04,40.96 C22.2
N$42
  Bottom 0.254: R17.2 R15.2 5.58,64.84 7.39,64.84 8.45,65.9 8.45,66.2 IC4.4
N$43  (via drill 0.4)
  Top 0.254: v19.5,61 19.01,60.51 10.79,60.51 8.62,58.33 8.62,56.58 7.15,55.12 5.71,55.12 5.16,55.66 5.06,55.77 5.06,58.16 2.54,60.68 2.54,66.65 3.48,67.58 5.02,67.58 5.75,66.84 v7.54,66.84
  Bottom 0.2: 27.9,36.3 27.9,18.7 27.65,18.45
  Bottom 0.254: v19.5,61 20.4,60.1 22,60.1 23,61.1 23.7,61.1 24.7,60.1 26.2,60.1 26.88,59.42 26.88,50.38 24.6,48.1 24.6,45.9 | IC6.6 21.2,47.3 21.2,47 22.3,45.9 24.6,45.9 | 24.6,45.9 24.6,42.3 27.9,39 27.9,36.3 | 7.2,69.27 IC4.5 7.17,67.58 7.54,67.2 v7.54,66.84 | 27.65,18.45 27.3,18.1 R34.1 26.29,17.39 26,17.1 25.49,17.1 C25.1
N$44  (via drill 0.4)
  Top 0.254: v27.4,14.9 27.4,23.6 24.4,26.6 17,26.6 14.5,29.1 v14.5,36.4
  Bottom 0.254: IC6.7 22.48,50.23 22.2,50.5 15.9,50.5 14.79,49.39 14.77,43.14 13.72,42.09 13.72,37.18 v14.5,36.4 | v27.4,14.9 26.87,14.37 R35.1 26.1,14.53 26.1,16.01 C25.2
N$68  (via drill 0.4)
  Top 0.254: v4.2,62.9 4.2,61.71 C6.-
  Bottom 0.254: R15.1 4.2,63.54 v4.2,62.9
Q_CV  (via drill 0.4)
  Top 0.254: RES_CV.P3 v4.93,19.1
  Bottom 0.254: R39.1 2.2,6.9 1.61,7.49 1.61,14.2 4.85,17.45 | 4.85,17.45 4.93,17.52 | v4.93,19.1 4.93,17.52 | 4.93,17.52 4.85,17.45
REF_-5  (via drill 0.4)
  Top 0.254: R1.2 17.74,47.08 IC1.2 17.74,51.04 v18.2,51.5 | R1.2 C3.1 | R1.2 17.82,47 | CUTOFF.P$3 11.76,55.24 13.3,53.7 v15.2,53.7
  Bottom 0.254: v18.2,51.5 16,53.7 v15.2,53.7
VCA_CV
  Bottom 0.254: R36.1 19.7,8.5 19.7,3.3 18.09,1.69 GAIN_CV.P3
VCA_IN  (via drill 0.4)
  Top 0.254: v23.2,60 23.99,60 v25.44,61.45
  Bottom 0.254: v25.44,61.45 26.52,61.45 27.39,62.32 27.39,67.4 26.55,68.24 26.55,70.51 25.95,71.11 25.95,71.95 26.71,72.72 26.71,75.95 27.96,77.21 27.96,89.17 27.72,89.42 | R22.1 7.83,55.63 8.3,56.1 8.3,56.9 9.19,57.79 10.52,57.79 11,58.27 21.47,58.27 v23.2,60 | FILTER_MODE.P2-OP 26.1,91.04 27.72,89.42 | 27.72,89.42 27.94,89.2
VCA_OUT
  Bottom 0.254: R34.2 23.5,17.01 23.5,16.2 23.5,16 23,15.5 22.1,14.6 22.1,7.8 23.76,6.14 OUTPUT.P3 25.94,3.87 R35.2
VCC  (via drill 0.4)
  Top 0.254: v6,76.3 6.27,76.03 C10.1 6.31,74.51 6.3,74.5 6.3,73.4 6.8,72.9 23.74,72.9 v24,72.64 24.69,73.33 24.69,74.42 | 4.8,90.9 4.8,88.8 9,84.6 RESONANCE.P$1 | 4.8,90.9 5.7,91.8 | 4.8,90.9 4.8,95 5.99,96.19 10.61,96.19 v11.9,94.9
  Top 0.305: P2.1 22.15,52.55 23.51,51.19 v23.51,50.7 C4.1 | 24.69,74.42 C8.1 | v2.4,25.3 1.17,26.53 1.17,38.37 5.44,42.64 5.44,47.64 7.36,49.56 C5.+ 7.36,53.3 6.58,54.08 5.27,54.08 2.13,57.22 2.13,59.47 1.5,60.1 1.5,74.4 2.6,75.5 5.2,75.5 v6,76.3 6,79.2 9,82.2 RESONANCE.P$1 | v5.3,25.3 7.16,23.44 7.16,21.1 8.45,19.81 v18.18,19.81 18.18,13.28 v17.1,12.2 17.1,14.07 14.77,16.4 9.9,16.4 v8.3,14.8
  Top 0.508: P2.1 12.86,52.8 D2.C C5.+
  Bottom 0.254: 7.4,8.01 IC8.8 7.1,9.75 C27.1 | R40.2 19.48,12.2 v17.1,12.2 | 19,96.47 IC3.8 19.04,95.2 18.73,94.9 v11.9,94.9 | v6,76.3 5.91,76.2 IC4.11 | IC5.16 25.07,73.23 24.57,72.73 24.09,72.73 v24,72.64 | IC2.8 8.48,94.4 8.98,94.9 v11.9,94.9 | C12.1 11.88,94.92 v11.9,94.9
  Bottom 0.305: IC6.8 23.75,50.47 v23.51,50.7 | C24.1 16.68,20.18 IC7.8 16.5,19.81 v18.18,19.81 | v2.4,25.3 v5.3,25.3 | C27.1 8.3,10.95 v8.3,14.8
VEE  (via drill 0.4)
  Top 0.254: R1.1 17.76,44.55 v18.5,43.81 18.84,44.15 C2.2 | 15.39,74.89 15.39,74.9 | 15.39,74.9 v15.39,75.9 | C9.2 15.84,74.45 15.39,74.9 | v13.2,85.9 10,85.9 v9.9,85.8 | C11.2 15.89,87.89 v16.6,88.6
  Top 0.305: C1.- 7.53,43.73 1.73,37.93 1.73,27.47 v2.5,26.7 | C7.2 6.28,70.92 v6,71.2 7.1,70.1 15.9,70.1 16.5,70.7 v16.5,71.2 17.3,70.4 26.2,70.4 27.13,69.47 27.13,46.63 26.1,45.6 24.8,45.6 24.3,45.1 24.3,42 23.7,41.4 20.91,41.4 v18.5,43.81 15.79,43.81 14.37,45.23 P1.1 | v19.5,16.1 19.5,8.3 v17.1,5.9 7.7,5.9 6.6,7 6.6,22.7 4.4,24.9 v4.4,26.7 | v4.1,77.4 4.1,78.05 2.55,79.6 2.55,85.75 3.6,86.8 v3.6,88
  Top 0.508: C1.- 8.42,45.5 D1.A 12.79,45.5 P1.1
  Bottom 0.254: 15.12,91.2 IC3.4 15.22,89.97 v16.6,88.6 | C29.2 14.4,4.2 IC8.4 | v3.6,88 3.6,86.9 5.18,85.32 9.42,85.32 v9.9,85.8 | v13.2,85.9 13.9,85.9 v16.6,88.6 | v16.6,88.6 17.85,88.6 R5.1 | IC5.9 16.18,75.72 16,75.9 v15.39,75.9
  Bottom 0.305: C26.2 20.64,15.13 IC7.4 v19.5,16.09 v19.5,16.1 | IC6.4 18.86,43.45 v18.5,43.81 | IC4.6 5.91,71.11 v6,71.2 3.2,71.2 2.24,72.16 2.24,75.24 4.1,77.1 v4.1,77.4 | v16.5,71.2 16.18,71.53 IC5.9 | v2.5,26.7 v4.4,26.7 | v17.1,5.9 15,5.9 14.5,5.4 14.5,4.3 14.4,4.2 | v3.6,88 4.58,88 IC2.4

### Text on the board
tPlace: APEM-MHS233K | COMMON | COMMON
bPlace: WAVELET | v1.0 | By Shay Shezifi (PLUM) | Based on Ripples By: / Olivier Gillet | CC-BY-SA 4.0